# Altium schematic sheet CHECK.SchDoc
size A4
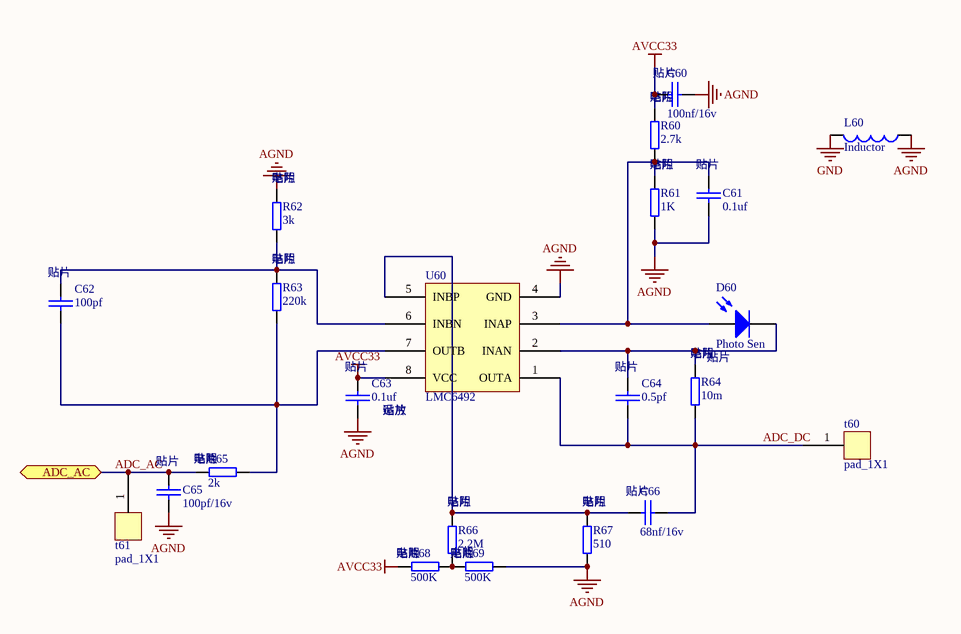
[diagram p0: CHECK.SchDoc]

## Parts
C60  100nf/16v  [C0402]
C61  0.1uf  [C0402]
C62  100pf  [C0402]
C63  0.1uf  [C0402]
C64  0.5pf  [C0402]
C65  100pf/16v  [C0402]
C66  68nf/16v  [C0402]
D60  Photo Sen  [PhotoSen]
L60  Inductor  [L0402]
R60  2.7k  [R0402]
R61  1K  [R0402]
R62  3k  [R0402]
R63  220k  [R0402]
R64  10m  [R0402]
R65  2k  [R0402]
R66  2.2M  [R0402]
R67  510  [R0402]
R68  500K  [R0402]
R69  500K  [R0402]
t60  pad_1X1  [pad_0603]
t61  pad_1X1  [pad_0603]
U60  LMC6492  [SO-8]

## Ports
ADC_AC

## Nets
AGND: C60.2 C61.2 C63.2 C65.1 L60.1 R61.2 R62.1 R67.2 R69.2 U60.4(GND)
AVCC33: C60.1 C63.1 R60.1 R68.1 U60.8(VCC)
GND: L60.2
ADC_AC: C65.2 R65.1 t61.1 ; port ADC_AC
ADC_DC: C64.2 C66.2 R64.2 t60.1 U60.1(OUTA)
NetC61_1: C61.1 D60.1(A) R60.2 R61.1 U60.3(INAP)
NetC62_1: C62.1 R62.2 R63.1 U60.6(INBN)
NetC62_2: C62.2 R63.2 R65.2 U60.7(OUTB)
NetC64_1: C64.1 D60.2(K) R64.1 U60.2(INAN)
NetC66_1: C66.1 R66.1 R67.1 U60.5(INBP)
NetR66_2: R66.2 R68.2 R69.1

## Notes on the sheet
- (in symbol CC) 贴片
- (in symbol LMC6492) 贴片; 运放
- (in symbol Photo Sen) 贴片
- (in symbol RES1) 电阻; 贴片

## Library data of the parts
C60 C61 C63 = CC: C; 大?: 0.1uf/50v; 封?: 0603
C62 C65 = CC: C; 大?: 100pF/50v; 封?: 0603
C64 = CC: C; 大?: 0.5pf/50v; 封?: 0603
C66 = CC: C; 大?: 68nf/50v; 封?: 0603
D60 = Photo Sen: Photosensitive Diode; 产?: *; 厂?: *; 大?: *; 封?: *; 价?: *; 型?: *; 资?: *
L60 = Inductor: Code_IEC: 1005; Published: 8-Jun-2000; LatestRevisionDate: 29-May-2009; LatestRevisionNote: IPC-7351 Footprint Added.; PackageReference: 0402-A; Publisher: Altium Limited; PackageDescription: Chip Inductor; Code_JEITA: 0402
R60-R69 = RES1: R; 价?: 0.01; 封?: 0603
  R60: 大?: 2.7k
  R61: 大?: 1k
  R62: 大?: 3k
  R63: 大?: 220k
  R64: 大?: 10m
  R65: 大?: 2k
  R66: 大?: 2.2M
  R67: 大?: 510
  R68 R69: 大?: 500K
U60 = LMC6492: 产?: *; 厂?: *; 大?: *; 封?: *; 价?: *; 型?: LMC6492; 资?: *